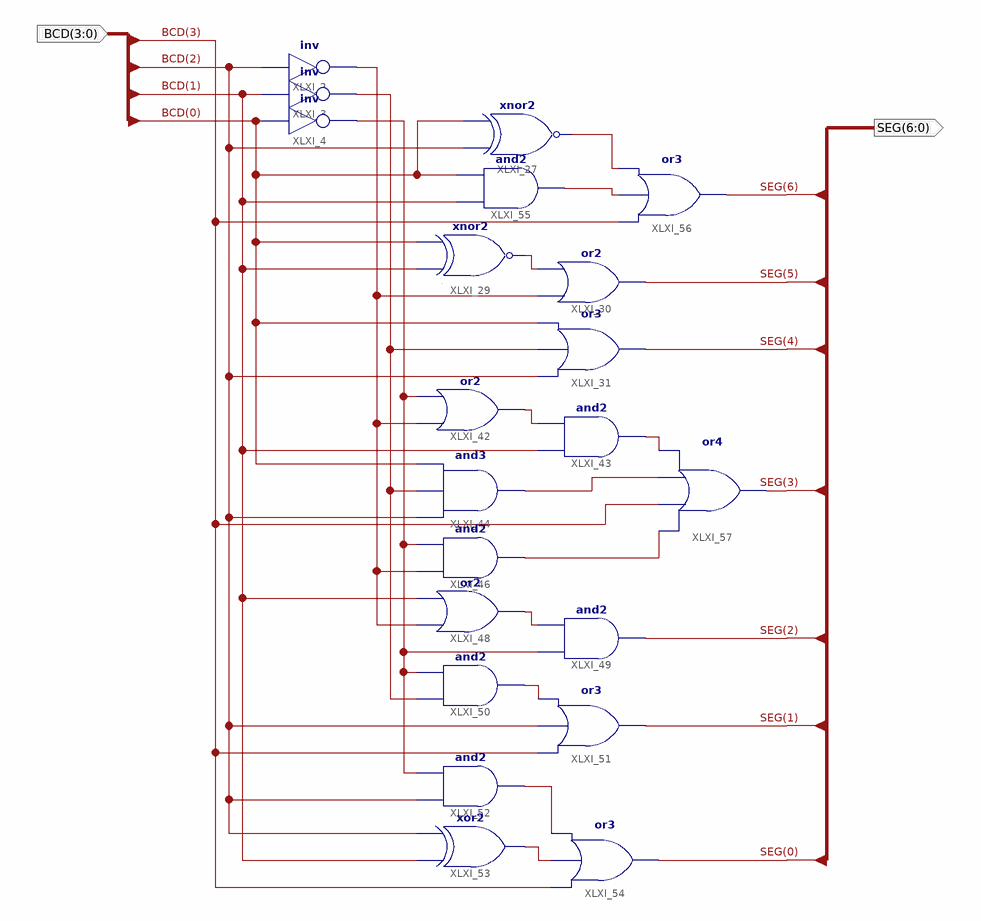
[diagram p0: schematic sheet 1]
// Xilinx ISE schematic Decoder_BCDto7Seg.sch (spartan6) as structural Verilog: 21 symbols, 2 ports
module Decoder_BCDto7Seg (
  input  [3:0] BCD,
  output [6:0] SEG
);

  wire QA_INV, QB_INV, QC_INV, XLXN_59, XLXN_72, XLXN_77, XLXN_93, XLXN_98, XLXN_99, XLXN_101, XLXN_102,
       XLXN_164, XLXN_165, XLXN_166;

  not XLXI_2 (QC_INV, BCD[2]);
  not XLXI_3 (QB_INV, BCD[1]);
  not XLXI_4 (QA_INV, BCD[0]);
  or XLXI_54 (SEG[0], BCD[3], XLXN_102, XLXN_101);
  and XLXI_44 (XLXN_166, BCD[2], QB_INV, BCD[0]);
  and XLXI_43 (XLXN_93, BCD[1], XLXN_72);
  or XLXI_31 (SEG[4], BCD[2], QB_INV, BCD[0]);
  or XLXI_30 (SEG[5], QC_INV, XLXN_59);
  or XLXI_42 (XLXN_72, QC_INV, QA_INV);
  xnor XLXI_29 (XLXN_59, BCD[1], BCD[0]);
  and XLXI_46 (XLXN_77, QC_INV, QA_INV);
  or XLXI_48 (XLXN_98, QC_INV, BCD[1]);
  and XLXI_50 (XLXN_99, QB_INV, QA_INV);
  and XLXI_49 (SEG[2], QA_INV, XLXN_98);
  or XLXI_51 (SEG[1], BCD[3], BCD[2], XLXN_99);
  and XLXI_52 (XLXN_101, BCD[2], QA_INV);
  xor XLXI_53 (XLXN_102, BCD[1], BCD[2]);
  or XLXI_56 (SEG[6], BCD[3], XLXN_165, XLXN_164);
  xnor XLXI_27 (XLXN_164, BCD[2], BCD[0]);
  and XLXI_55 (XLXN_165, BCD[1], BCD[0]);
  or XLXI_57 (SEG[3], XLXN_77, BCD[3], XLXN_166, XLXN_93);
endmodule
